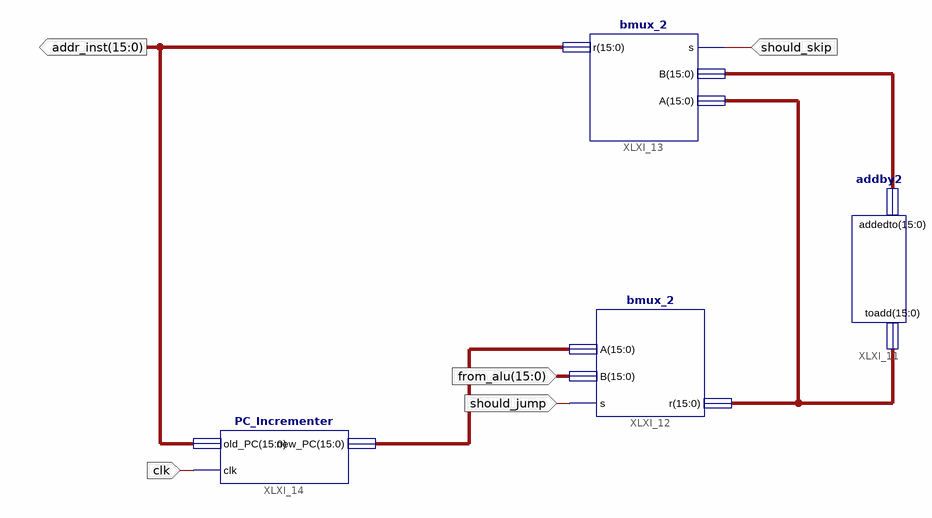
[diagram p0: schematic sheet 1]
// Xilinx ISE schematic Datapath_PC_Fragment.sch (spartan3e) as structural Verilog: 4 symbols, 5 ports
module Datapath_PC_Fragment (
  input  clk,
  input  should_jump,
  input  [15:0] from_alu,
  input  should_skip,
  output [15:0] addr_inst
);

  wire [15:0] XLXN_11, XLXN_12, XLXN_13;

  addby2 XLXI_11 (.toadd(XLXN_12), .addedto(XLXN_13));
  bmux_2 XLXI_12 (.A(XLXN_11), .B(from_alu), .s(should_jump), .r(XLXN_12));
  bmux_2 XLXI_13 (.A(XLXN_12), .B(XLXN_13), .s(should_skip), .r(addr_inst));
  PC_Incrementer XLXI_14 (.old_PC(addr_inst), .new_PC(XLXN_11), .clk(clk));
endmodule
